# EasyEDA schematic Small Vitals_2021-03-09.json
TITLE: Small Vitals Tiva TM4C123G; REV: 1.0; Date: 2021-03-09; Sheet: 1/1; Drawn By: Aniket Randive; Company: StringBrane Technologies Pvt. Ltd.
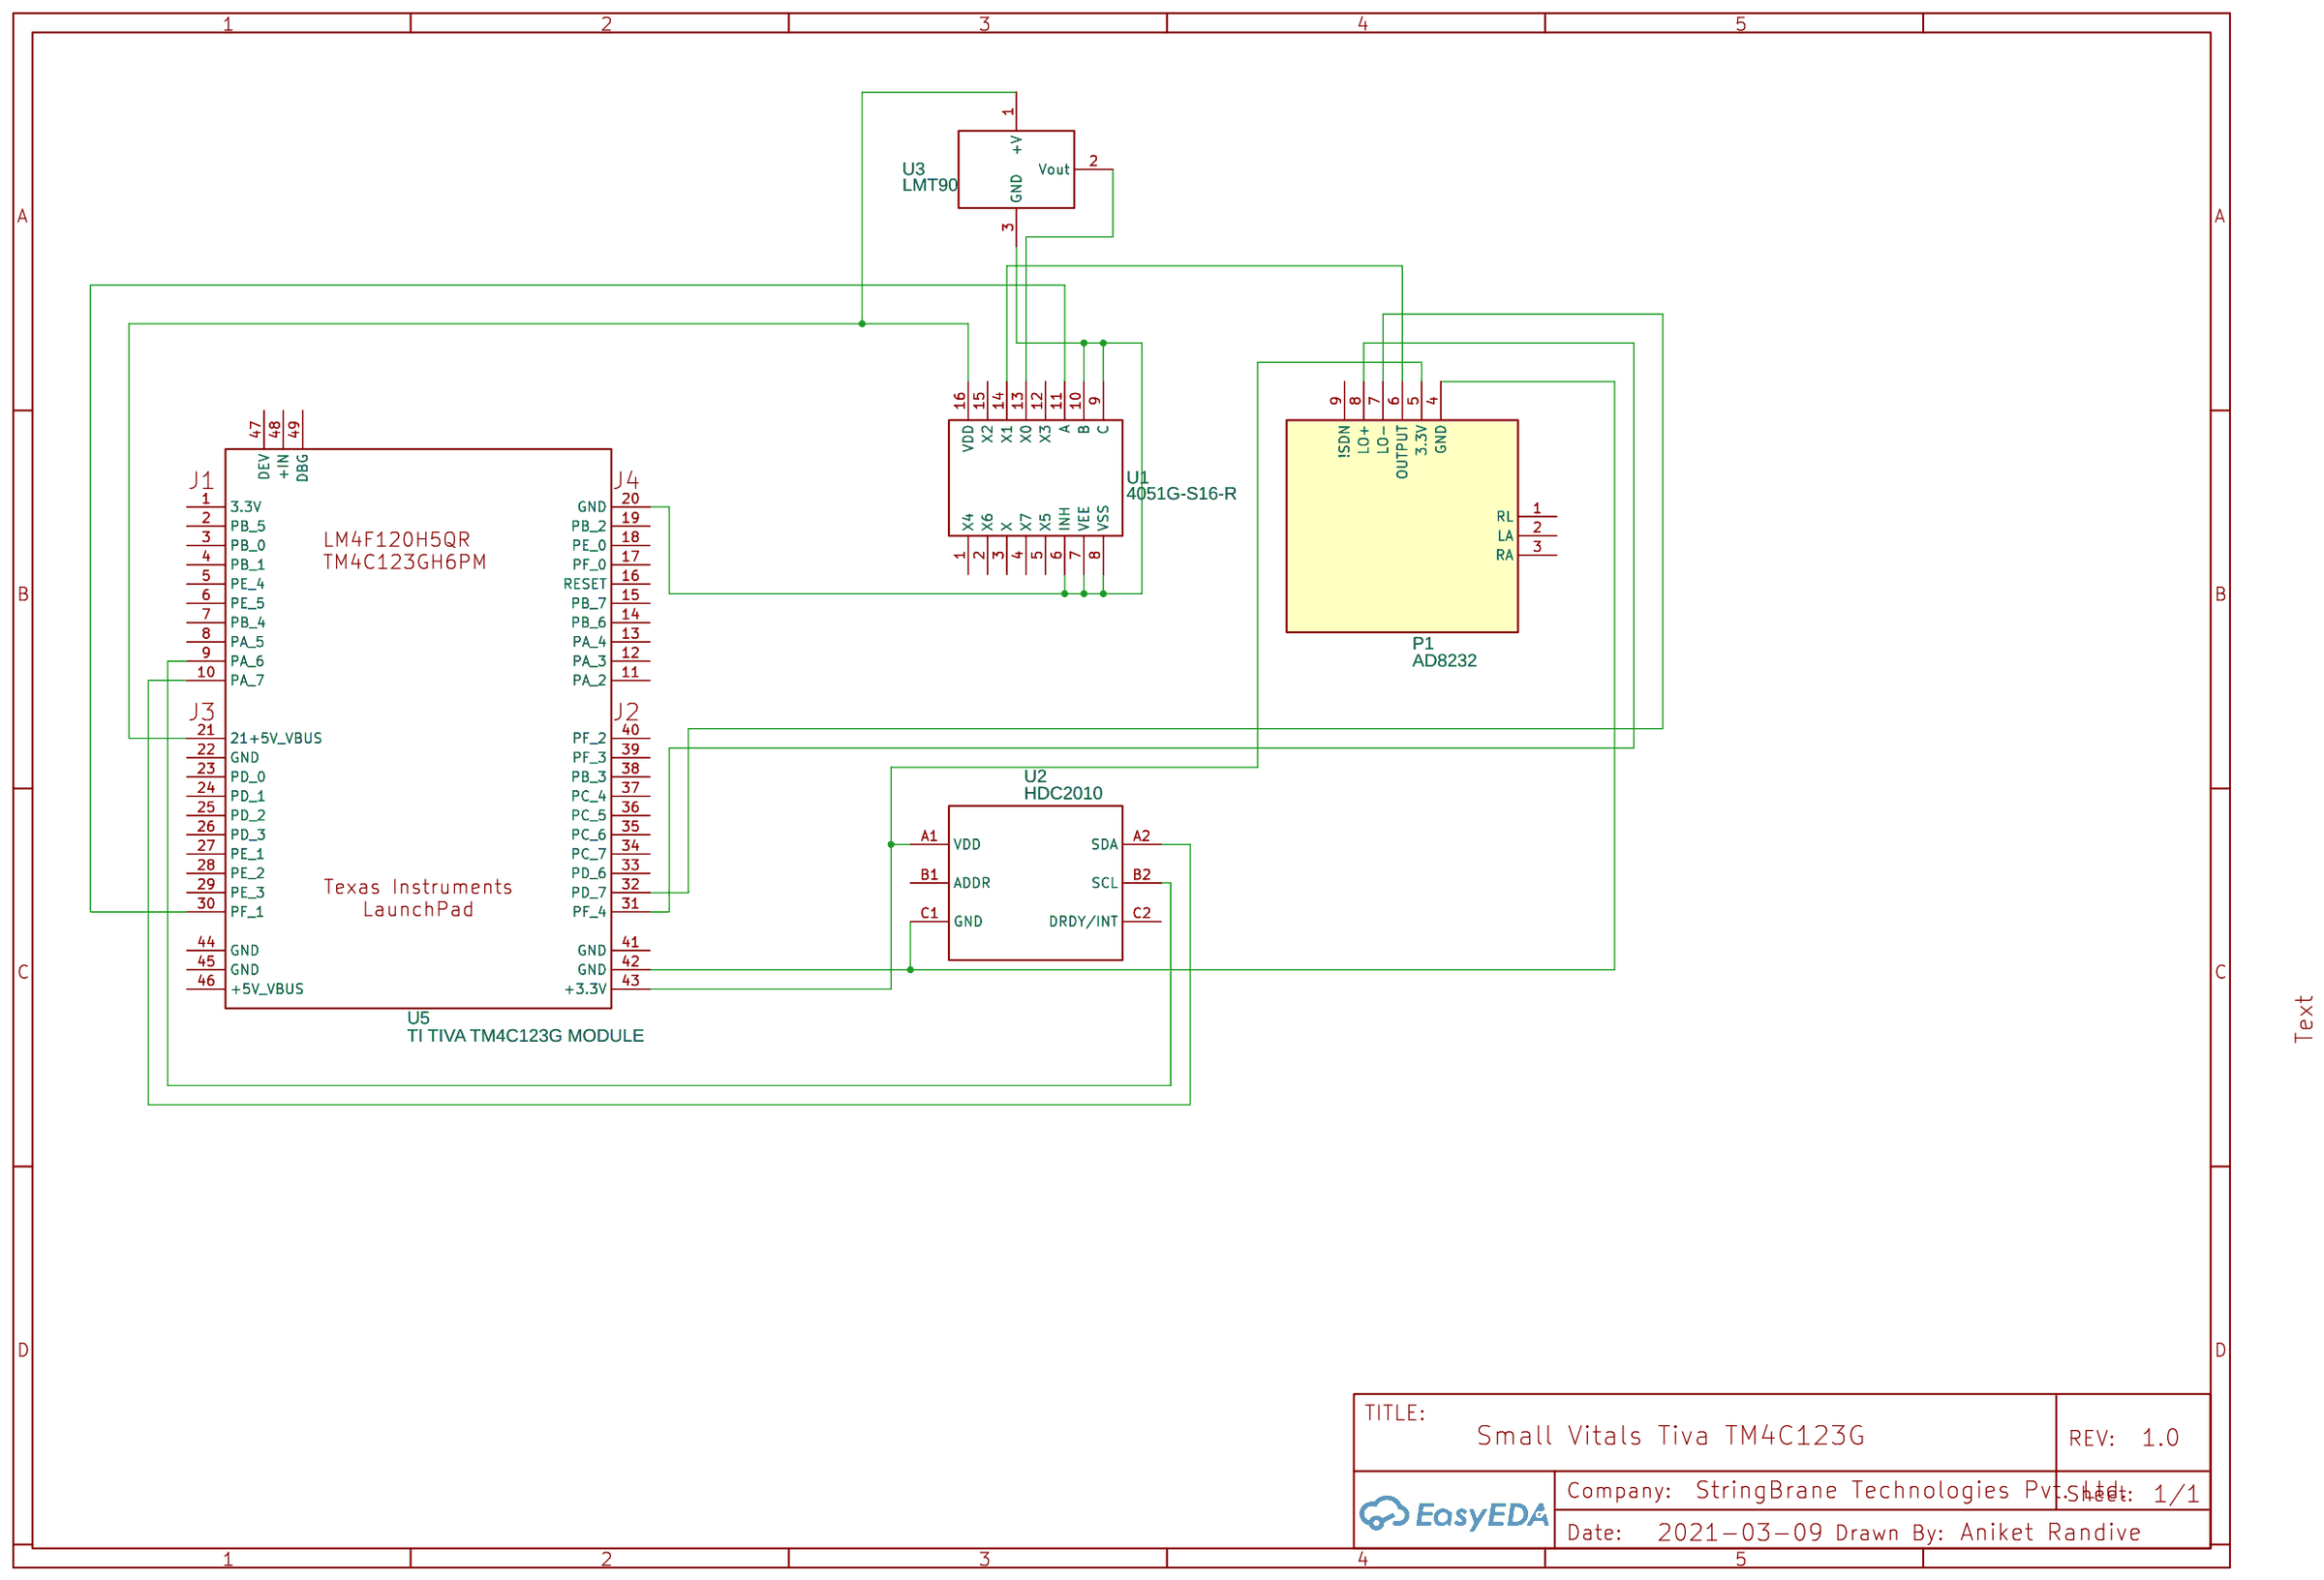
[diagram p0: schematic sheet]

## Parts
P1  AD8232  [AD8232]
U1  4051G-S16-R  [SOIC-16_L9.9-W3.9-P1.27-LS6.0-BL]
U2  HDC2010  [DSBGA6]
U3  LMT90  [SOT-23]
U5  TI TIVA TM4C123G MODULE

## Library data of the parts
P1 = AD8232: sourceId: 96QK2WNHZ; Supplier Part: 12587; Supplier: SparkFun
U1 = 4051G-S16-R: Supplier: LCSC; Manufacturer: UTC; Supplier Part: C73279; SMT Type: Extend; JLCPCB SMD: Yes; LCSC Assembly: Yes; Assembly Type: smtWeld; Paste Type: expand
U2 = HDC2010: link: http://www.ti.com/lit/ds/symlink/hdc2010.pdf; Contributor: Munken
U3 = LMT90: Contributor: nick10mc; link: http://www.ti.com/lit/ds/symlink/lmt90.pdf
U5 = TI TIVA TM4C123G MODULE: Contributor: Mal-EDA

## Nets
Net-(P1-4): P1.4(GND) U2.C1(GND) U5.42(GND)
Net-(P1-5): P1.5(3.3V) U2.A1(VDD) U5.43(+3.3V)
Net-(P1-6): P1.6(OUTPUT) U1.14(X1)
Net-(P1-7): P1.7(LO-) U5.32(PD_7)
Net-(P1-8): P1.8(LO+) U5.31(PF_4)
Net-(U1-6): U1.6(INH) U1.7(VEE) U1.8(VSS) U1.9(C) U1.10(B) U3.3(GND) U5.20(GND)
Net-(U1-11): U1.11(A) U5.30(PF_1)
Net-(U1-13): U1.13(X0) U3.2(Vout)
Net-(U1-16): U1.16(VDD) U3.1(+V) U5.21(21+5V VBUS)
Net-(U2-A2): U2.A2(SDA) U5.10(PA_7)
Net-(U2-B2): U2.B2(SCL) U5.9(PA_6)

Not connected (* = marked no-connect by the designer): P1 1(RL) 2(LA) 3(RA) 9(!SDN); U1 1(X4) 2(X6) 3(X) 4(X7) 5(X5) 12(X3) 15(X2); U2 B1(ADDR) C2(DRDY/INT); U5 1(3.3V) 2(PB_5) 3(PB_0) 4(PB_1) 5(PE_4) 6(PE_5) 7(PB_4) 8(PA_5) 11(PA_2) 12(PA_3) 13(PA_4) 14(PB_6) 15(PB_7) 16(RESET) 17(PF_0) 18(PE_0) 19(PB_2) 22(GND) 23(PD_0) 24(PD_1) 25(PD_2) 26(PD_3) 27(PE_1) 28(PE_2) 29(PE_3) 33(PD_6) 34(PC_7) 35(PC_6) 36(PC_5) 37(PC_4) 38(PB_3) 39(PF_3) 40(PF_2) 41(GND) 44(GND) 45(GND) 46(+5V VBUS) 47(DEV) 48(+IN) 49(DBG)
